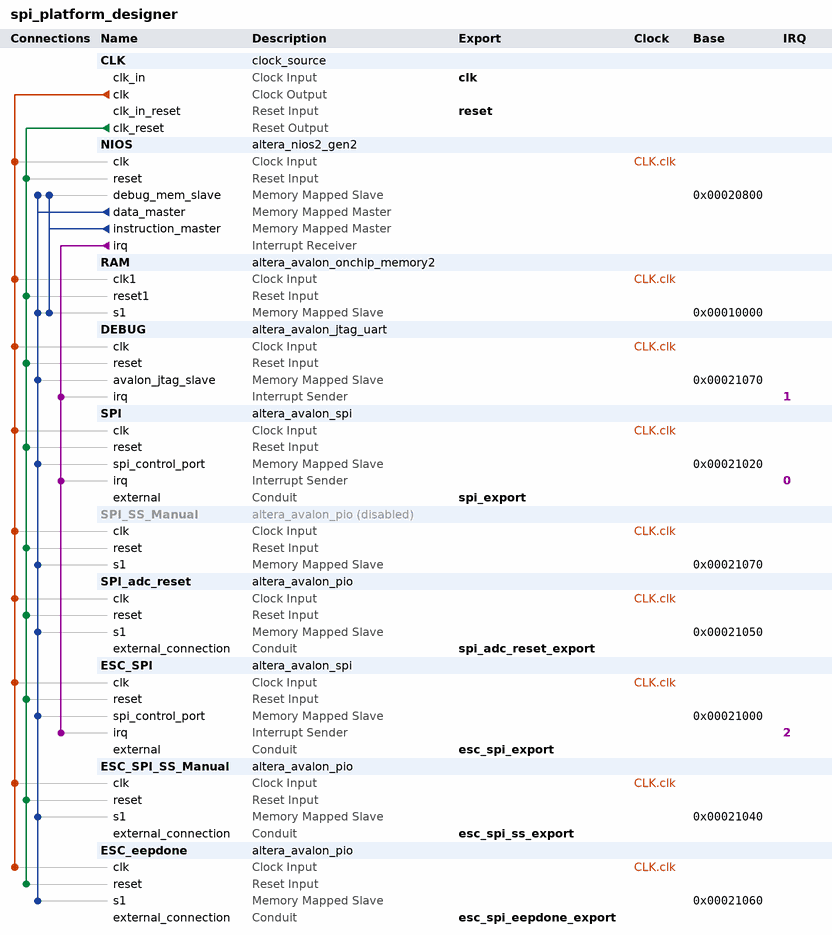
[diagram p0: system contents]
# Platform Designer (Qsys) system spi_platform_designer, Cyclone 10 LP 10CL025YU256I7G
# Parameters at their usual value, and those the tool derives, are not listed.
package require -exact qsys 23.1
create_system spi_platform_designer
set_project_property DEVICE_FAMILY {Cyclone 10 LP}
set_project_property DEVICE 10CL025YU256I7G

add_instance CLK clock_source 23.1
set_instance_parameter_value CLK clockFrequency 50000000

add_instance NIOS altera_nios2_gen2 23.1
set_instance_parameter_value NIOS dcache_size 2048
set_instance_parameter_value NIOS exceptionSlave RAM.s1
set_instance_parameter_value NIOS icache_size 4096
set_instance_parameter_value NIOS impl Tiny
set_instance_parameter_value NIOS resetSlave RAM.s1

add_instance RAM altera_avalon_onchip_memory2 23.1
set_instance_parameter_value RAM dataWidth 32
set_instance_parameter_value RAM dualPort false
set_instance_parameter_value RAM initMemContent true
set_instance_parameter_value RAM initializationFileName onchip_mem.hex
set_instance_parameter_value RAM memorySize 40960

add_instance DEBUG altera_avalon_jtag_uart 23.1
set_instance_parameter_value DEBUG simInteractiveOptions NO_INTERACTIVE_WINDOWS

add_instance SPI altera_avalon_spi 23.1
set_instance_parameter_value SPI clockPhase 1
set_instance_parameter_value SPI clockPolarity 0
set_instance_parameter_value SPI dataWidth 8
set_instance_parameter_value SPI masterSPI true
set_instance_parameter_value SPI numberOfSlaves 1
set_instance_parameter_value SPI targetClockRate 3125000

add_instance SPI_SS_Manual altera_avalon_pio 23.1
set_instance_property SPI_SS_Manual ENABLED false
set_instance_parameter_value SPI_SS_Manual direction Output
set_instance_parameter_value SPI_SS_Manual width 1

add_instance SPI_adc_reset altera_avalon_pio 23.1
set_instance_parameter_value SPI_adc_reset direction Output
set_instance_parameter_value SPI_adc_reset resetValue 1
set_instance_parameter_value SPI_adc_reset width 1

add_instance ESC_SPI altera_avalon_spi 23.1
set_instance_parameter_value ESC_SPI clockPhase 1
set_instance_parameter_value ESC_SPI clockPolarity 1
set_instance_parameter_value ESC_SPI dataWidth 8
set_instance_parameter_value ESC_SPI masterSPI true
set_instance_parameter_value ESC_SPI numberOfSlaves 1
set_instance_parameter_value ESC_SPI targetClockRate 5000000

add_instance ESC_SPI_SS_Manual altera_avalon_pio 23.1
set_instance_parameter_value ESC_SPI_SS_Manual direction Output
set_instance_parameter_value ESC_SPI_SS_Manual resetValue 1
set_instance_parameter_value ESC_SPI_SS_Manual width 1

add_instance ESC_eepdone altera_avalon_pio 23.1
set_instance_parameter_value ESC_eepdone direction Input
set_instance_parameter_value ESC_eepdone width 1

# connections
add_connection CLK.clk DEBUG.clk clock
add_connection CLK.clk ESC_eepdone.clk clock
add_connection CLK.clk ESC_SPI.clk clock
add_connection CLK.clk ESC_SPI_SS_Manual.clk clock
add_connection CLK.clk NIOS.clk clock
add_connection CLK.clk RAM.clk1 clock
add_connection CLK.clk SPI.clk clock
add_connection CLK.clk SPI_adc_reset.clk clock
add_connection CLK.clk SPI_SS_Manual.clk clock
add_connection CLK.clk_reset DEBUG.reset reset
add_connection CLK.clk_reset ESC_eepdone.reset reset
add_connection CLK.clk_reset ESC_SPI.reset reset
add_connection CLK.clk_reset ESC_SPI_SS_Manual.reset reset
add_connection CLK.clk_reset NIOS.reset reset
add_connection CLK.clk_reset RAM.reset1 reset
add_connection CLK.clk_reset SPI.reset reset
add_connection CLK.clk_reset SPI_adc_reset.reset reset
add_connection CLK.clk_reset SPI_SS_Manual.reset reset
add_connection NIOS.data_master DEBUG.avalon_jtag_slave avalon
set_connection_parameter_value NIOS.data_master/DEBUG.avalon_jtag_slave baseAddress 0x00021070
add_connection NIOS.data_master ESC_eepdone.s1 avalon
set_connection_parameter_value NIOS.data_master/ESC_eepdone.s1 baseAddress 0x00021060
add_connection NIOS.data_master ESC_SPI.spi_control_port avalon
set_connection_parameter_value NIOS.data_master/ESC_SPI.spi_control_port baseAddress 0x00021000
add_connection NIOS.data_master ESC_SPI_SS_Manual.s1 avalon
set_connection_parameter_value NIOS.data_master/ESC_SPI_SS_Manual.s1 baseAddress 0x00021040
add_connection NIOS.data_master NIOS.debug_mem_slave avalon
set_connection_parameter_value NIOS.data_master/NIOS.debug_mem_slave baseAddress 0x00020800
add_connection NIOS.data_master RAM.s1 avalon
set_connection_parameter_value NIOS.data_master/RAM.s1 baseAddress 0x00010000
add_connection NIOS.data_master SPI.spi_control_port avalon
set_connection_parameter_value NIOS.data_master/SPI.spi_control_port baseAddress 0x00021020
add_connection NIOS.data_master SPI_adc_reset.s1 avalon
set_connection_parameter_value NIOS.data_master/SPI_adc_reset.s1 baseAddress 0x00021050
add_connection NIOS.data_master SPI_SS_Manual.s1 avalon
set_connection_parameter_value NIOS.data_master/SPI_SS_Manual.s1 baseAddress 0x00021070
add_connection NIOS.instruction_master NIOS.debug_mem_slave avalon
set_connection_parameter_value NIOS.instruction_master/NIOS.debug_mem_slave baseAddress 0x00020800
add_connection NIOS.instruction_master RAM.s1 avalon
set_connection_parameter_value NIOS.instruction_master/RAM.s1 baseAddress 0x00010000
add_connection NIOS.irq DEBUG.irq interrupt
set_connection_parameter_value NIOS.irq/DEBUG.irq irqNumber 1
add_connection NIOS.irq ESC_SPI.irq interrupt
set_connection_parameter_value NIOS.irq/ESC_SPI.irq irqNumber 2
add_connection NIOS.irq SPI.irq interrupt
set_connection_parameter_value NIOS.irq/SPI.irq irqNumber 0

# exported interfaces
add_interface clk clock sink
set_interface_property clk EXPORT_OF CLK.clk_in
add_interface esc_spi_eepdone_export conduit end
set_interface_property esc_spi_eepdone_export EXPORT_OF ESC_eepdone.external_connection
add_interface esc_spi_export conduit end
set_interface_property esc_spi_export EXPORT_OF ESC_SPI.external
add_interface esc_spi_ss_export conduit end
set_interface_property esc_spi_ss_export EXPORT_OF ESC_SPI_SS_Manual.external_connection
add_interface reset reset sink
set_interface_property reset EXPORT_OF CLK.clk_in_reset
add_interface spi_adc_reset_export conduit end
set_interface_property spi_adc_reset_export EXPORT_OF SPI_adc_reset.external_connection
add_interface spi_export conduit end
set_interface_property spi_export EXPORT_OF SPI.external

set_interconnect_requirement {$system} qsys_mm.clockCrossingAdapter HANDSHAKE
set_interconnect_requirement {$system} qsys_mm.enableEccProtection FALSE
set_interconnect_requirement {$system} qsys_mm.insertDefaultSlave FALSE
set_interconnect_requirement {$system} qsys_mm.maxAdditionalLatency 1

save_system spi_platform_designer.qsys
